# Altium schematic sheet MCU.SchDoc
size A2; SheetNumber: 12; SheetTotal: 25
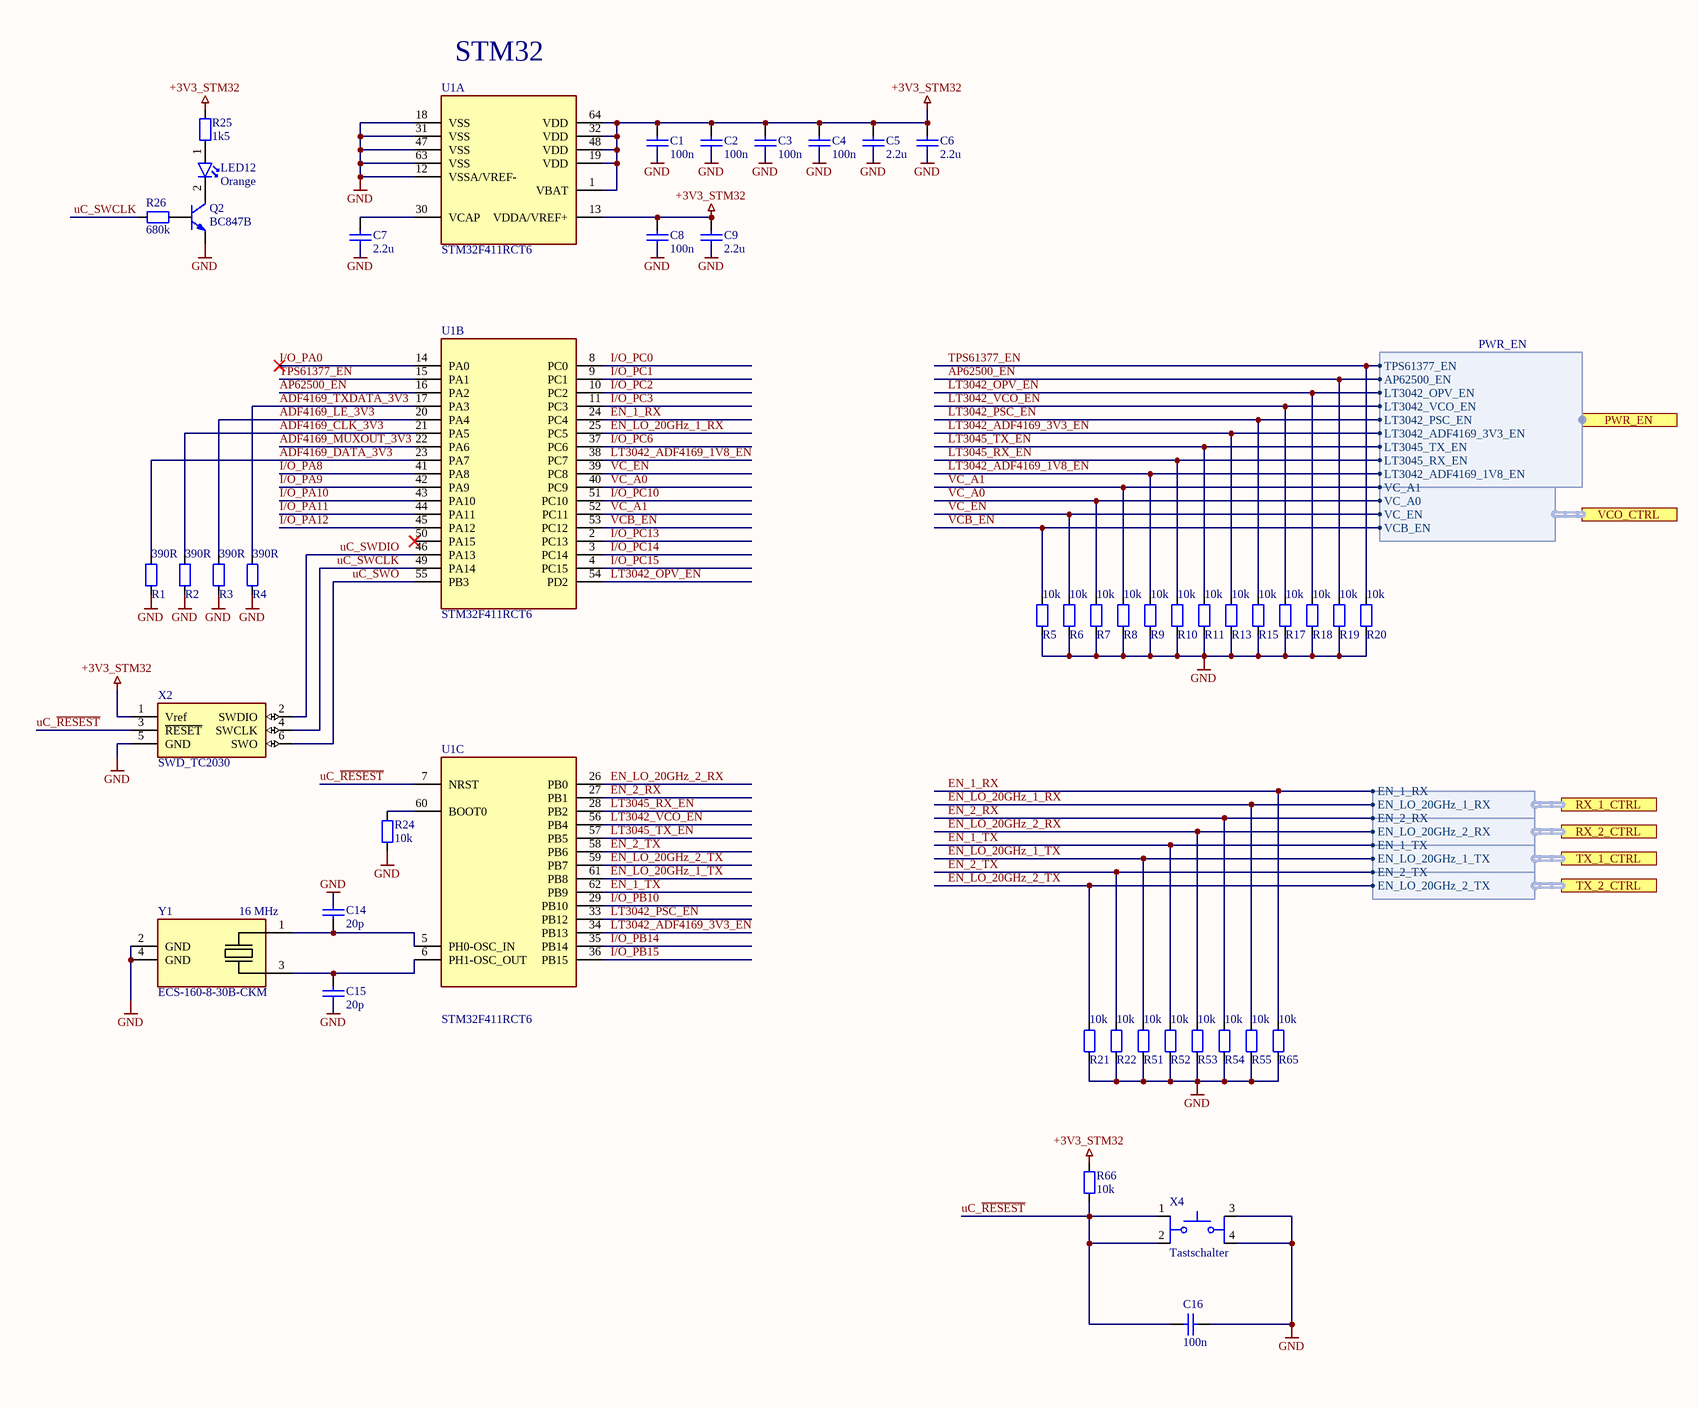
[diagram p0: MCU.SchDoc, left]
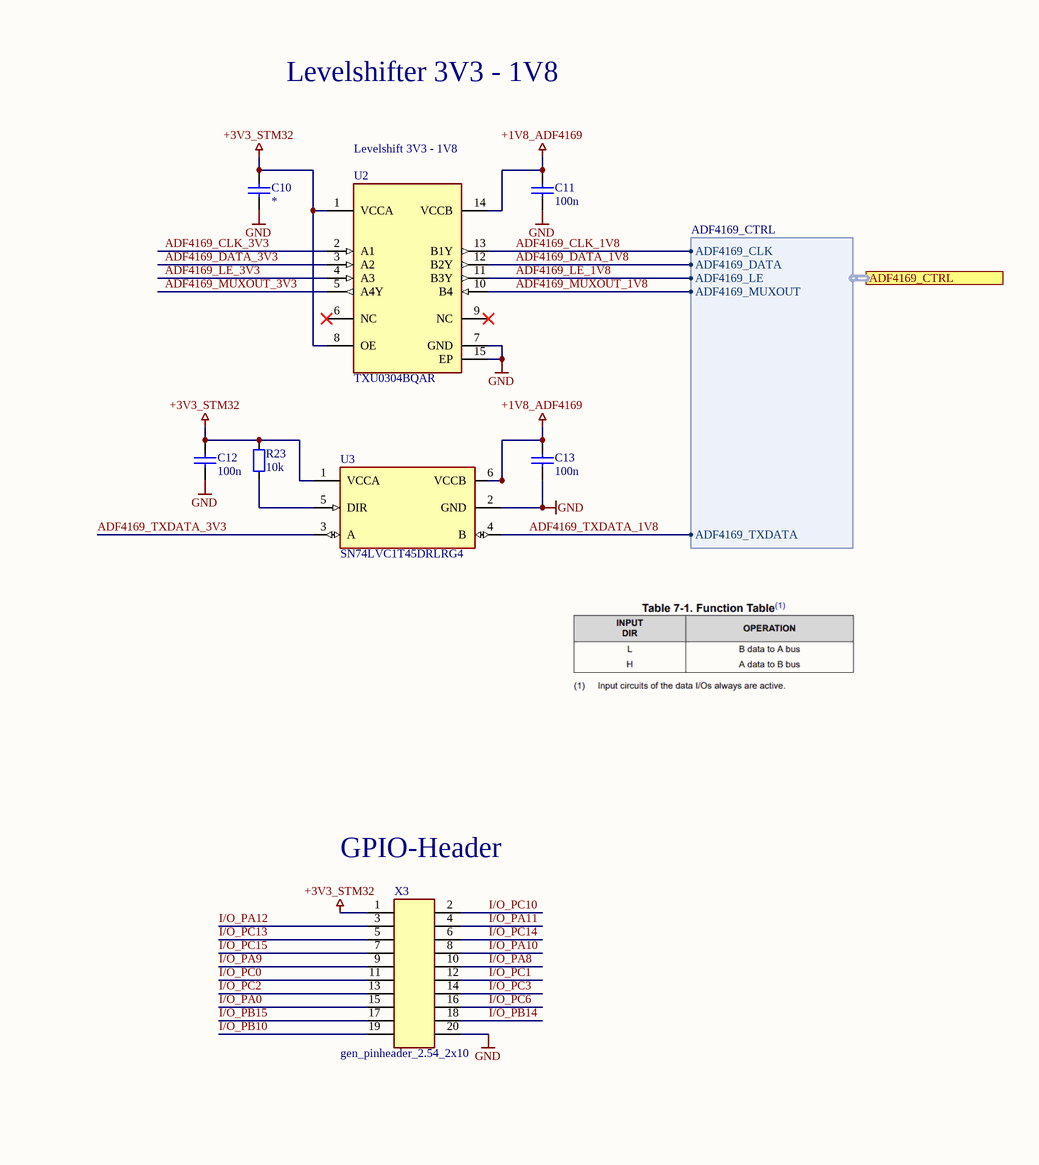
[diagram p1: MCU.SchDoc, right]

## Parts
C1  100n  [C_0402_1005Metric_IPC_N]
C2  100n  [C_0402_1005Metric_IPC_N]
C3  100n  [C_0402_1005Metric_IPC_N]
C4  100n  [C_0402_1005Metric_IPC_N]
C5  2.2u  [C_0603_1608Metric_IPC_N]
C6  2.2u  [C_0603_1608Metric_IPC_N]
C7  2.2u  [C_0603_1608Metric_IPC_N]
C8  100n  [C_0402_1005Metric_IPC_N]
C9  2.2u  [C_0603_1608Metric_IPC_N]
C10  *  [C_0402_1005Metric_IPC_N]
C11  100n  [C_0402_1005Metric_IPC_N]
C12  100n  [C_0402_1005Metric_IPC_N]
C13  100n  [C_0402_1005Metric_IPC_N]
C14  20p  [C_0402_1005Metric_IPC_N]
C15  20p  [C_0402_1005Metric_IPC_N]
C16  100n  [C_0402_1005Metric_IPC_N]
LED12  Orange  [LED_0603_1806Metric_IPC_N]
Q2  BC847B  [SOT-23-3]
R1  390R  [R_0402_1005Metric_IPC_N]
R2  390R  [R_0402_1005Metric_IPC_N]
R3  390R  [R_0402_1005Metric_IPC_N]
R4  390R  [R_0402_1005Metric_IPC_N]
R5  10k  [R_0402_1005Metric_IPC_N]
R6  10k  [R_0402_1005Metric_IPC_N]
R7  10k  [R_0402_1005Metric_IPC_N]
R8  10k  [R_0402_1005Metric_IPC_N]
R9  10k  [R_0402_1005Metric_IPC_N]
R10  10k  [R_0402_1005Metric_IPC_N]
R11  10k  [R_0402_1005Metric_IPC_N]
R13  10k  [R_0402_1005Metric_IPC_N]
R15  10k  [R_0402_1005Metric_IPC_N]
R17  10k  [R_0402_1005Metric_IPC_N]
R18  10k  [R_0402_1005Metric_IPC_N]
R19  10k  [R_0402_1005Metric_IPC_N]
R20  10k  [R_0402_1005Metric_IPC_N]
R21  10k  [R_0402_1005Metric_IPC_N]
R22  10k  [R_0402_1005Metric_IPC_N]
R23  10k  [R_0402_1005Metric_IPC_N]
R24  10k  [R_0402_1005Metric_IPC_N]
R25  1k5  [R_0402_1005Metric_IPC_N]
R26  680k  [R_0402_1005Metric_IPC_N]
R51  10k  [R_0402_1005Metric_IPC_N]
R52  10k  [R_0402_1005Metric_IPC_N]
R53  10k  [R_0402_1005Metric_IPC_N]
R54  10k  [R_0402_1005Metric_IPC_N]
R55  10k  [R_0402_1005Metric_IPC_N]
R65  10k  [R_0402_1005Metric_IPC_N]
R66  10k  [R_0402_1005Metric_IPC_N]
U1  STM32F411RCT6  [QFP50P1200X1200X160-64N]  (parts A,B,C of 3)
U2  TXU0304BQAR  [WQFN-14-1EP_2.5x3mm_P0.5mm_EP1.0x1.5mm_IPC_N]
U3  SN74LVC1T45DRLRG4  [SOTFL50P160X60-6N]
X2  SWD_TC2030  [Tag-Connect_TC2030-IDC-FP_2x03_P1.27mm_Vertical]  (no BOM)
X3  gen_pinheader_2.54_2x10  [Pinheader_2.54_2x10]
X4  Tastschalter  [TL3301AF160QG]
Y1  ECS-160-8-30B-CKM  [XTAL_SMD_5032_4Pin_5x3.2mm]

## Ports
ADF4169_CTRL (harness ADF4169_CTRL, see Top_Level[2B], PLL_ADF4169[1C]), PWR_EN (harness PWR_EN, see Top_Level[2B], Power_Supply[1A]), RX_1_CTRL (harness RX_1_CTRL, see Top_Level[2B], RX_RUBVERANO[2C]), RX_2_CTRL (harness RX_2_CTRL, see Top_Level[2B], RX_RUBVERANO[7C]), TX_1_CTRL (harness TX_1_CTRL, see Top_Level[2B], TX_RUBVERANO[7D]), TX_2_CTRL (harness TX_2_CTRL, see Top_Level[2B], TX_RUBVERANO[2D]), VCO_CTRL (harness VCO_CTRL, see Top_Level[2B], VCO_HMC8364[1B])

## Harnesses
ADF4169_CTRL: ADF4169_MUXOUT, ADF4169_CLK, ADF4169_DATA, ADF4169_LE, ADF4169_TXDATA
PWR_EN: AP62500_EN, LT3042_OPV_EN, LT3042_VCO_EN, LT3042_PSC_EN, LT3042_ADF4169_3V3_EN, LT3045_TX_EN, TPS61377_EN, LT3042_ADF4169_1V8_EN, LT3045_RX_EN
VCO_CTRL: VCB_EN, VC_EN, VC_A0, VC_A1
RX_1_CTRL: EN_1_RX, EN_LO_20GHz_1_RX
RX_2_CTRL: EN_2_RX, EN_LO_20GHz_2_RX
TX_1_CTRL: EN_LO_20GHz_1_TX, EN_1_TX
TX_2_CTRL: EN_LO_20GHz_2_TX, EN_2_TX

## Nets
+1V8_ADF4169: C11.2 C13.2 U2.14(VCCB) U3.6(VCCB)
+3V3_STM32: C1.2 C2.2 C3.2 C4.2 C5.2 C6.2 C8.2 C9.2 C10.2 C12.2 R23.1 R25.2 R66.2 U1.1(VBAT) U1.13(VDDA/VREF+) U1.19(VDD) U1.32(VDD) U1.48(VDD) U1.64(VDD) U2.1(VCCA) U2.8(OE) U3.1(VCCA) X2.1(Vref) X3.1
GND: C1.1 C2.1 C3.1 C4.1 C5.1 C6.1 C7.1 C8.1 C9.1 C10.1 C11.1 C12.1 C13.1 C14.2 C15.1 C16.2 Q2.2(E) R1.1 R2.1 R3.1 R4.1 R5.1 R6.1 R7.1 R8.1 R9.1 R10.1 R11.1 R13.1 R15.1 R17.1 R18.1 R19.1 R20.1 R21.1 R22.1 R24.2 R51.1 R52.1 R53.1 R54.1 R55.1 R65.1 U1.12(VSSA/VREF-) U1.18(VSS) U1.31(VSS) U1.47(VSS) U1.63(VSS) U2.7(GND) U2.15(EP) U3.2(GND) X2.5(GND) X3.20 X4.3 X4.4 Y1.2(GND) Y1.4(GND)
ADF4169_CLK_1V8: U2.13(B1Y) ; port ADF4169_CTRL.ADF4169_CLK
ADF4169_CLK_3V3: R2.2 U1.21(PA5) U2.2(A1)
ADF4169_DATA_1V8: U2.12(B2Y) ; port ADF4169_CTRL.ADF4169_DATA
ADF4169_DATA_3V3: R1.2 U1.23(PA7) U2.3(A2)
ADF4169_LE_1V8: U2.11(B3Y) ; port ADF4169_CTRL.ADF4169_LE
ADF4169_LE_3V3: R3.2 U1.20(PA4) U2.4(A3)
ADF4169_MUXOUT_1V8: U2.10(B4) ; port ADF4169_CTRL.ADF4169_MUXOUT
ADF4169_MUXOUT_3V3: U1.22(PA6) U2.5(A4Y)
ADF4169_TXDATA_1V8: U3.4(B) ; port ADF4169_CTRL.ADF4169_TXDATA
ADF4169_TXDATA_3V3: R4.2 U1.17(PA3) U3.3(A)
AP62500_EN: R19.2 U1.16(PA2) ; port PWR_EN.AP62500_EN
EN_1_RX: R65.2 U1.24(PC4) ; port RX_1_CTRL.EN_1_RX
EN_1_TX: R52.2 U1.62(PB9) ; port TX_1_CTRL.EN_1_TX
EN_2_RX: R54.2 U1.27(PB1) ; port RX_2_CTRL.EN_2_RX
EN_2_TX: R22.2 U1.58(PB6) ; port TX_2_CTRL.EN_2_TX
EN_LO_20GHz_1_RX: R55.2 U1.25(PC5) ; port RX_1_CTRL.EN_LO_20GHz_1_RX
EN_LO_20GHz_1_TX: R51.2 U1.61(PB8) ; port TX_1_CTRL.EN_LO_20GHz_1_TX
EN_LO_20GHz_2_RX: R53.2 U1.26(PB0) ; port RX_2_CTRL.EN_LO_20GHz_2_RX
EN_LO_20GHz_2_TX: R21.2 U1.59(PB7) ; port TX_2_CTRL.EN_LO_20GHz_2_TX
I/O_PA0: U1.14(PA0) X3.15
I/O_PA8: U1.41(PA8) X3.10
I/O_PA9: U1.42(PA9) X3.9
I/O_PA10: U1.43(PA10) X3.8
I/O_PA11: U1.44(PA11) X3.4
I/O_PA12: U1.45(PA12) X3.3
I/O_PB10: U1.29(PB10) X3.19
I/O_PB14: U1.35(PB14) X3.18
I/O_PB15: U1.36(PB15) X3.17
I/O_PC0: U1.8(PC0) X3.11
I/O_PC1: U1.9(PC1) X3.12
I/O_PC2: U1.10(PC2) X3.13
I/O_PC3: U1.11(PC3) X3.14
I/O_PC6: U1.37(PC6) X3.16
I/O_PC10: U1.51(PC10) X3.2
I/O_PC13: U1.2(PC13) X3.5
I/O_PC14: U1.3(PC14) X3.6
I/O_PC15: U1.4(PC15) X3.7
LT3042_ADF4169_1V8_EN: R9.2 U1.38(PC7) ; port PWR_EN.LT3042_ADF4169_1V8_EN
LT3042_ADF4169_3V3_EN: R13.2 U1.34(PB13) ; port PWR_EN.LT3042_ADF4169_3V3_EN
LT3042_OPV_EN: R18.2 U1.54(PD2) ; port PWR_EN.LT3042_OPV_EN
LT3042_PSC_EN: R15.2 U1.33(PB12) ; port PWR_EN.LT3042_PSC_EN
LT3042_VCO_EN: R17.2 U1.56(PB4) ; port PWR_EN.LT3042_VCO_EN
LT3045_RX_EN: R10.2 U1.28(PB2) ; port PWR_EN.LT3045_RX_EN
LT3045_TX_EN: R11.2 U1.57(PB5) ; port PWR_EN.LT3045_TX_EN
TPS61377_EN: R20.2 U1.15(PA1) ; port PWR_EN.TPS61377_EN
uC_~{RESEST}: C16.1 R66.1 U1.7(NRST) X2.3(~{RESET}) X4.1 X4.2
uC_SWCLK: R26.1 U1.49(PA14) X2.4(SWCLK)
uC_SWDIO: U1.46(PA13) X2.2(SWDIO)
uC_SWO: U1.55(PB3) X2.6(SWO)
VC_A0: R7.2 U1.40(PC9) ; port VCO_CTRL.VC_A0
VC_A1: R8.2 U1.52(PC11) ; port VCO_CTRL.VC_A1
VC_EN: R6.2 U1.39(PC8) ; port VCO_CTRL.VC_EN
VCB_EN: R5.2 U1.53(PC12) ; port VCO_CTRL.VCB_EN
NetC7_2: C7.2 U1.30(VCAP)
NetC14_1: C14.1 U1.5(PH0-OSC_IN) Y1.1(IN/OUT)
NetC15_2: C15.2 U1.6(PH1-OSC_OUT) Y1.3(IN/OUT)
NetLED12_1: LED12.1 R25.1
NetLED12_2: LED12.2 Q2.3(C)
NetQ2_1: Q2.1(B) R26.2
NetR23_2: R23.2 U3.5(DIR)
NetR24_1: R24.1 U1.60(BOOT0)

Not connected (* = marked no-connect by the designer): U1 50(PA15)*; U2 6(NC)* 9(NC)*

## Notes on the sheet
- STM32
- Levelshifter 3V3 - 1V8
- Levelshift 3V3 - 1V8
- (near X3) GPIO-Header
- (near Y1) 16 MHz

## Library data of the parts
C1-C4 C8 C11-C13 = C000002: Generic MLCC with 0402 Footprint; Specific Component: False; Tolerance: 10%; Temp Coefficient: X7R; Voltage Rated: 50V; ID: C000002; Capacitance: 100n; min Temperature: *; max Temperature: *; Case: 0402; Supplier 1: Mouser; Supplier Part Number 1: 81-GRM155R71H104KE4D; Supplier 2: Digikey; Supplier Part Number 2: 490-10700-1-ND
C5-C7 C9 = C000003: Generic MLCC with 0603 Footprint; Specific Component: False; ID: C000003; Capacitance: 2.2u; Tolerance: *; Temp Coefficient: *; Voltage Rated: *; min Temperature: *; max Temperature: *; Case: 0603; Supplier 1: Mouser; Supplier Part Number 1: 81-GRM188R61E225KA2D
C10 C14-C16 = C000002: Generic MLCC with 0402 Footprint; Specific Component: False; ID: C000002; Tolerance: *; Temp Coefficient: *; Voltage Rated: *; min Temperature: *; max Temperature: *; Case: 0402
  C10: Capacitance: *
  C14 C15: Capacitance: 20p; Supplier 1: Arrow Electronics; Supplier Part Number 1: C0402C200F5GACTU
  C16: Capacitance: 100n
LED12 = LED000008: MLCC, Low Current, Orange, 2.2V, 20mA, 0603; Manufacturer: Broadcom / Avago; Manufacturer Part Number: HSMD-C190; Specific Component: True; ID: LED000008; Type: Low Current; Colour: Orange; Forward Voltage: 2.2V; Current: 20mA; Case: 0603; ComponentLink1Description: Datasheet; ComponentLink1URL: https://www.mouser.de/datasheet/3/57/1/AV02_0551EN_DS_HSMx_Cxxx_25Mar2022.pdf; Supplier 1: Mouser; Supplier Part Number 1: 630-HSMD-C190; Supplier 2: Digikey; Supplier Part Number 2: 516-2489-1-ND
Q2 = PMIC000033: Manufacturer: Diotec Semiconductor; ID: PMIC000033; Type: NPN; Manufacturer Part Number: BC847B; Part Value: BC847B; Case: SOT-23-3; ComponentLink1Description: Datasheet; ComponentLink1URL: https://diotec.com/request/datasheet/bc846.pdf; Supplier 1: Digikey; Supplier Part Number 1: 4878-BC847BCT-ND; Supplier 2: Mouser; Supplier Part Number 2: 637-BC847B
R1-R11 R13 R15 R17-R26 R51-R55 R65 R66 = R000002: Generic Chip Resistor with 0402 Footprint; Specific Component: False; ID: R000002; Tolerance: *; Power Rating: *; Composition: *; min Temperature: *; max Temperature: *; Temp Coefficient: *; Case: 0402
  R1-R4: Resistance: 390R
  R5-R11 R13 R15 R17-R24 R51-R55 R65 R66: Resistance: 10k
  R25: Resistance: 1k5
  R26: Resistance: 680k
U1 = MC000003: Arm Cortex-M4 32b MCU+FPU, 125 DMIPS, 512KB Flash, 128KB RAM, USB OTG FS, 11 TIMs, 1 ADC, 13 comm. interfaces; Manufacturer_Name: STMicroelectronics; Geometry.Height: 1.6mm; Mouser Part Number: 511-STM32F411RCT6; Mouser Price/Stock: https://www.mouser.co.uk/ProductDetail/STMicroelectronics/STM32F411RCT6?qs=pjMTYa9MTGUZXWYoQTNtbQ%3D%3D; Manufacturer_Part_Number: STM32F411RCT6; Datasheet Link: https://www.st.com/resource/en/datasheet/stm32f411ce.pdf; ID: MC000003; Manufacturer: STMicroelectronics; Manufacturer Part Number: STM32F411RCT6; Part Value: STM32F411RCT6; Case: LQFP-64; ComponentLink1Description: Datasheet; ComponentLink1URL: https://www.st.com/resource/en/datasheet/stm32f411ce.pdf; Supplier 1: Mouser; Supplier Part Number 1: 511-STM32F411RCT6; Supplier 2: Digikey; Supplier Part Number 2: 497-14908-ND
U2 = LG000017: Manufacturer: Texas Instruments; ID: LG000017; Type: Level Shifter; Manufacturer Part Number: TXU0304BQAR; Part Value: TXU0304BQAR; Case: 14-WQFN (2.5x3); ComponentLink1Description: Datasheet; ComponentLink1URL: https://www.ti.com/de/lit/gpn/txu0304; Supplier 1: Digikey; Supplier Part Number 1: 296-TXU0304BQARCT-ND; Supplier 2: Mouser; Supplier Part Number 2: 595-TXU0304BQAR
U3 = LG000019: Manufacturer: Texas Instruments; ID: LG000019; Type: Level Shifter; Manufacturer Part Number: SN74LVC1T45DRLRG4; Part Value: SN74LVC1T45DRLRG4; Case: SOT-6; ComponentLink1Description: Datasheet; ComponentLink1URL: https://www.ti.com/lit/ds/symlink/sn74lvc1t45.pdf?ts=1771738482652; Supplier 1: Digikey; Supplier Part Number 1: 296-52736-1-ND; Supplier 2: Mouser; Supplier Part Number 2: 595-74LVC1T45DRLRG4
X2 = X000003: Manufacturer Part Number: SWD TC2030; Manufacturer: Tag-Connect; ID: X000003; Type: SWD TC2030; Part Value: SWD TC2030; Case: TC2030; ComponentLink1Description: Datasheet; ComponentLink1URL: https://www.tag-connect.com/wp-content/uploads/bsk-pdf-manager/TC2030-CTX_1.pdf
X3 = X000025: Manufacturer Part Number: TSW-110-07-G-D; Manufacturer: Samtec; ID: X000025; Type: gen_pinheader_2.54_2x10; Part Value: gen_pinheader_2.54_2x10; ComponentLink1Description: Datasheet; ComponentLink1URL: https://www.mouser.de/datasheet/3/85/1/htsw_th.pdf; Supplier 1: Digikey; Supplier Part Number 1: SAM1028-10-ND; Supplier 2: Mouser; Supplier Part Number 2: 200-TSW11007GD
X4 = X000024: Manufacturer: E-Switch; ID: X000024; Type: Tastschalter; Manufacturer Part Number: TL3301AF160QG; Part Value: TL3301AF160QG; Case: TL3301; ComponentLink1Description: Datasheet; ComponentLink1URL: https://configured-product-images.s3.amazonaws.com/Datasheets/TL3301.pdf; Supplier 1: Digikey; Supplier Part Number 1: EG2526CT-ND
Y1 = Y000001: Manufacturer: ECS; ID: Y000001; Type: XTAL; Manufacturer Part Number: ECS-160-8-30B-CKM; Part Value: ECS-160-8-30B-CKM; Case: SMD 4-Pin 5x3.2mm; ComponentLink1Description: Datasheet; ComponentLink1URL: https://ecsxtal.com/store/pdf/ecx_53b.pdf; Supplier 1: Digikey; Supplier Part Number 1: XC1839CT-ND; Supplier 2: Mouser; Supplier Part Number 2: 520-160-8-30B-CKM